# EAGLE schematic covertwmount (EAGLE 9.6.2)
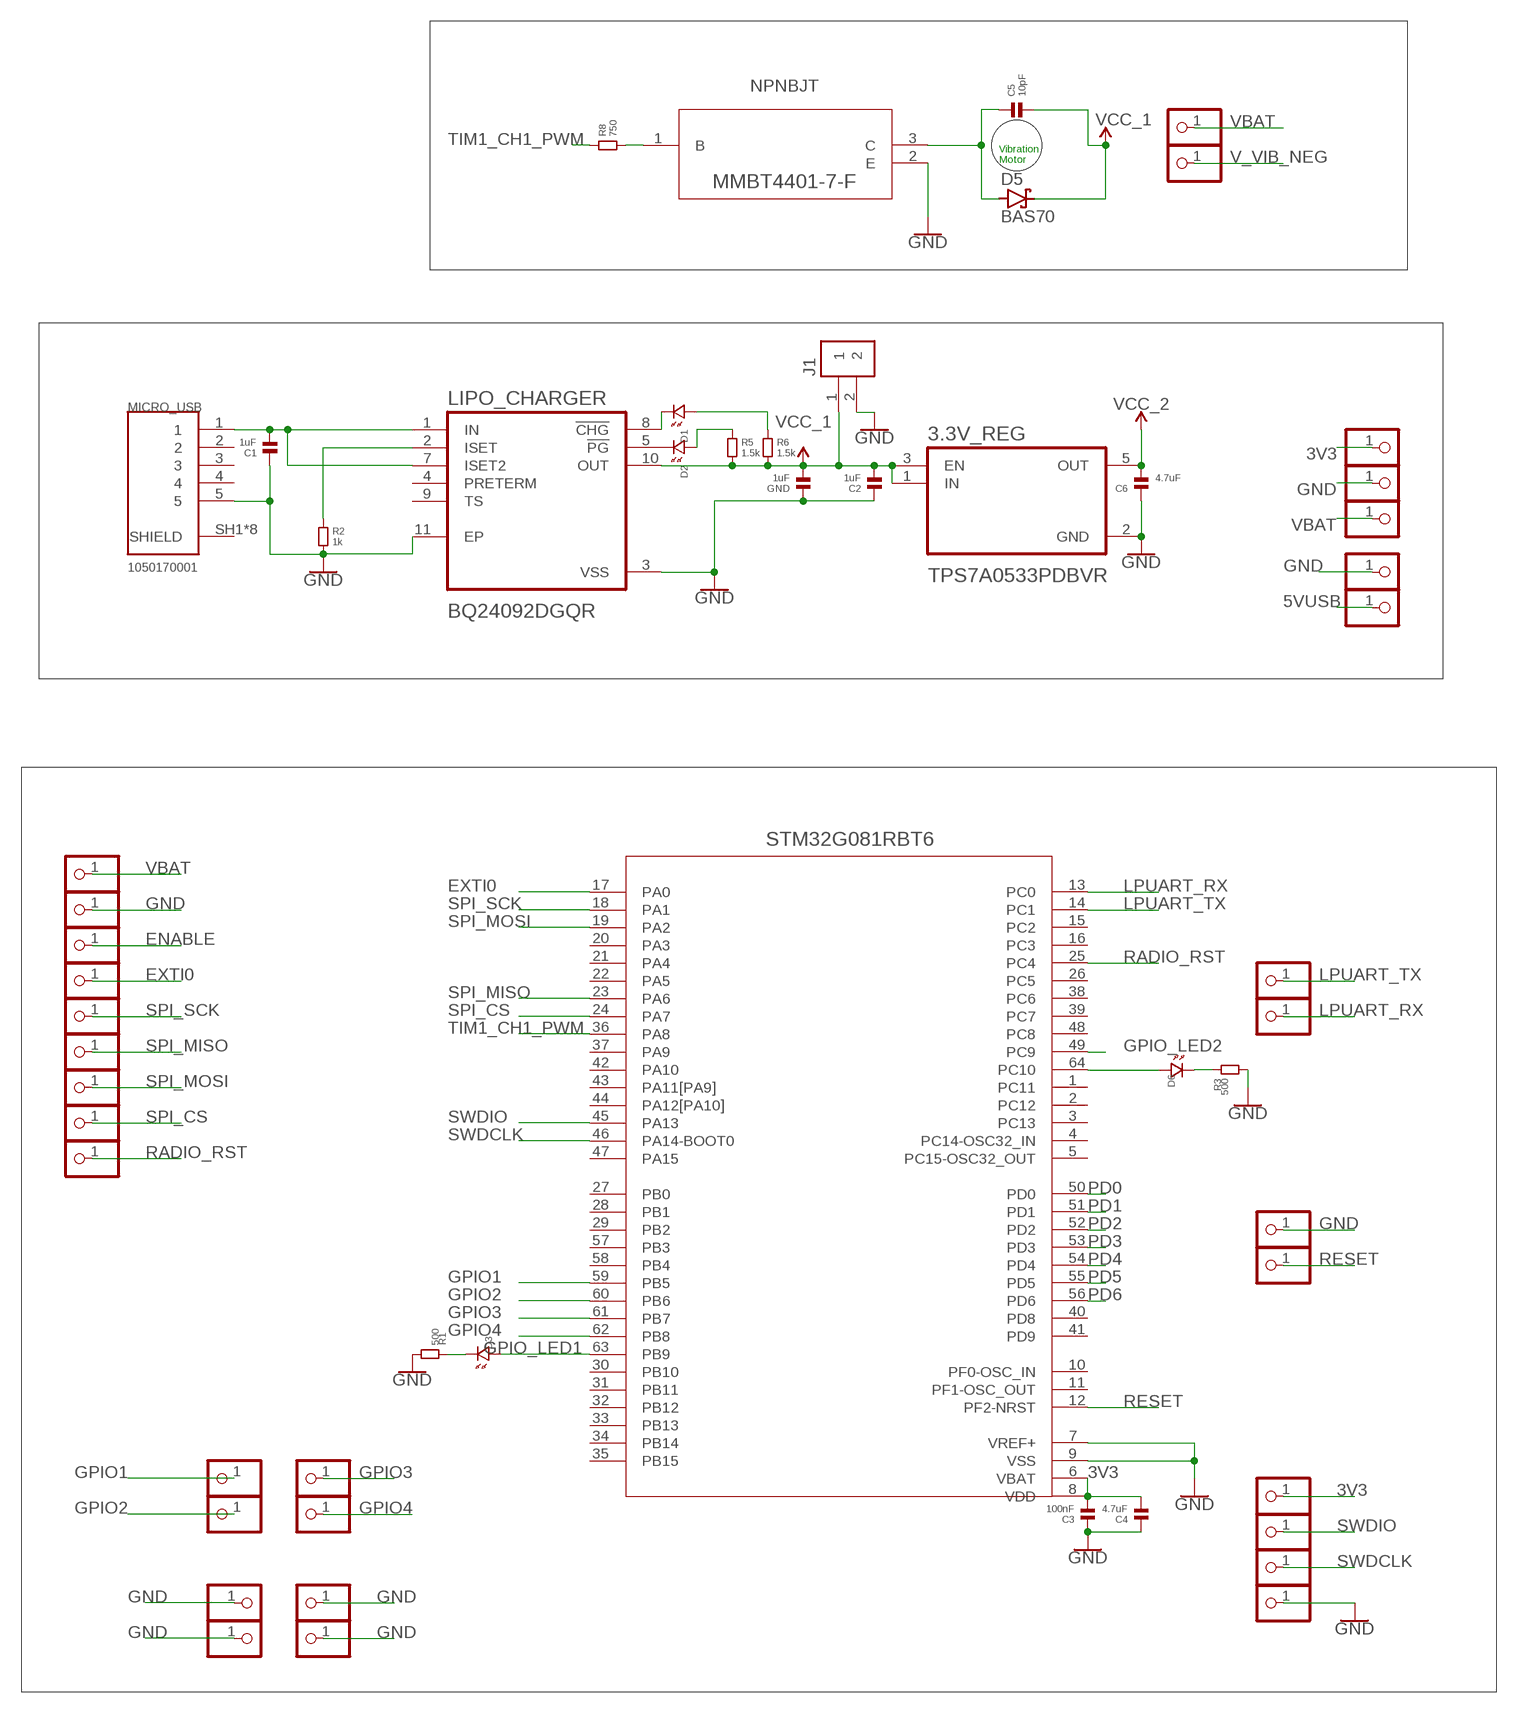
[diagram p0: schematic, sheet 1]

## Parts
3.3V_REG  TPS7A0533PDBVR  [SOT95P280X145-5N]
C1  1uF  CAPACITOR.0805  [0805]
C2  1uF  CAPACITOR.0805  [0805]
C3  100nF  CAPACITOR.0805  [0805]
C4  4.7uF  CAPACITOR.0805  [0805]
C5  10pF  CAPACITOR.0805  [0805]
C6  4.7uF  CAPACITOR.0805  [0805]
D1  LED.0805  [0805.LED]
D2  LED.0805  [0805.LED]
D3  LED.0805  [0805.LED]
D5  BAS70  [SOT23]
D6  LED.0805  [0805.LED]
GND  1uF  CAPACITOR.0805  [0805]
J1  B2B-PH-K-S(LF)(SN)  [JST_B2B-PH-K-S(LF)(SN)]
JP1  PINHD-1X1  [1X01]
JP2  PINHD-1X1  [1X01]
JP3  PINHD-1X1  [1X01]
JP4  PINHD-1X1  [1X01]
JP5  PINHD-1X1  [1X01]
JP6  PINHD-1X1  [1X01]
JP7  PINHD-1X1  [1X01]
JP8  PINHD-1X1  [1X01]
JP9  PINHD-1X1  [1X01]
JP10  PINHD-1X1  [1X01]
JP11  PINHD-1X1  [1X01]
JP12  PINHD-1X1  [1X01]
JP13  PINHD-1X1  [1X01]
JP14  PINHD-1X1  [1X01]
JP15  PINHD-1X1  [1X01]
JP16  PINHD-1X1  [1X01]
JP17  PINHD-1X1  [1X01]
JP18  PINHD-1X1  [1X01]
JP19  PINHD-1X1  [1X01]
JP20  PINHD-1X1  [1X01]
JP21  PINHD-1X1  [1X01]
JP22  PINHD-1X1  [1X01]
JP23  PINHD-1X1  [1X01]
JP24  PINHD-1X1  [1X01]
JP26  PINHD-1X1  [1X01]
JP27  PINHD-1X1  [1X01]
JP28  PINHD-1X1  [1X01]
JP29  PINHD-1X1  [1X01]
JP30  PINHD-1X1  [1X01]
JP31  PINHD-1X1  [1X01]
JP32  PINHD-1X1  [1X01]
JP33  PINHD-1X1  [1X01]
LIPO_CHARGER  BQ24092DGQR  [IC_XTR111AIDGQR]
MICRO_USB  1050170001  [MOLEX_1050170001]
R1  500  RESISTOR.0805  [0805]
R2  1k  RESISTOR.0805  [0805]
R3  500  RESISTOR.0805  [0805]
R5  1.5k  RESISTOR.0805  [0805]
R6  1.5k  RESISTOR.0805  [0805]
R8  750  RESISTOR.0805  [0805]
U1  STM32G081RBT6  [LQFP-64]
U2  MMBT4401-7-F  [SOT-23_DIO]

## Nets
3V3: 3.3V_REG.5(OUT) C3.2 C4.2 C6.2 JP4.1 JP16.1 U1.6(VBAT) U1.8(VDD) ; supply symbol labelled VCC_2
5VUSB: C1.2 JP30.1 LIPO_CHARGER.1(IN) LIPO_CHARGER.7(ISET2) MICRO_USB.1
ENABLE: JP11.1
EXTI0: JP10.1 U1.17(PA0)
GND: 3.3V_REG.2(GND) C1.1 C2.1 C3.1 C4.1 C6.1 GND.1 J1.2 JP3.1 JP12.1 JP15.1 JP23.1 JP26.1 JP27.1 JP28.1 JP29.1 JP33.1 LIPO_CHARGER.3(VSS) LIPO_CHARGER.11(EP) MICRO_USB.5 R1.1 R2.2 R3.1 U1.7(VREF+) U1.9(VSS) U2.2(E)
GPIO1: JP19.1 U1.59(PB5)
GPIO2: JP20.1 U1.60(PB6)
GPIO3: JP17.1 U1.61(PB7)
GPIO4: JP18.1 U1.62(PB8)
GPIO_LED1: D3.P$1 U1.63(PB9)
GPIO_LED2: D6.P$1 U1.64(PC10)
LPUART_RX: JP32.1 U1.13(PC0)
LPUART_TX: JP31.1 U1.14(PC1)
N$1: LIPO_CHARGER.2(ISET) R2.1
N$2: D6.P$2 R3.2
N$3: D3.P$2 R1.2
N$4: U1.49(PC9)
N$5: D2.P$1 R5.1
N$6: D1.P$1 R6.1
N$7: D2.P$2 LIPO_CHARGER.5(!PG)
N$8: R8.2 U2.1(B)
N$11: D1.P$2 LIPO_CHARGER.8(!CHG)
PD0: U1.50(PD0)
PD1: U1.51(PD1)
PD2: U1.52(PD2)
PD3: U1.53(PD3)
PD4: U1.54(PD4)
PD5: U1.55(PD5)
PD6: U1.56(PD6)
RADIO_RST: JP5.1 U1.25(PC4)
RESET: JP24.1 U1.12(PF2-NRST)
SPI_CS: JP6.1 U1.24(PA7)
SPI_MISO: JP8.1 U1.23(PA6)
SPI_MOSI: JP7.1 U1.19(PA2)
SPI_SCK: JP9.1 U1.18(PA1)
SWDCLK: JP2.1 U1.46(PA14-BOOT0)
SWDIO: JP1.1 U1.45(PA13)
TIM1_CH1_PWM: R8.1 U1.36(PA8)
V_VIB_NEG: C5.1 D5.1(A) JP22.1 U2.3(C)
VBAT: 3.3V_REG.1(IN) 3.3V_REG.3(EN) C2.2 C5.2 D5.3(C) GND.2 J1.1 JP13.1 JP14.1 JP21.1 LIPO_CHARGER.10(OUT) R5.2 R6.2 ; supply symbol labelled VCC_1
Unconnected: LIPO_CHARGER.4(PRETERM) LIPO_CHARGER.9(TS) MICRO_USB.2 MICRO_USB.3 MICRO_USB.4 MICRO_USB.SH1(SHIELD) MICRO_USB.SH2(SHIELD) MICRO_USB.SH3(SHIELD) MICRO_USB.SH4(SHIELD) MICRO_USB.SH5(SHIELD) MICRO_USB.SH6(SHIELD) MICRO_USB.SH7(SHIELD) MICRO_USB.SH8(SHIELD) U1.1(PC11) U1.2(PC12) U1.3(PC13) U1.4(PC14-OSC32_IN) U1.5(PC15-OSC32_OUT) U1.10(PF0-OSC_IN) U1.11(PF1-OSC_OUT) U1.15(PC2) U1.16(PC3) U1.20(PA3) U1.21(PA4) U1.22(PA5) U1.26(PC5) U1.27(PB0) U1.28(PB1) U1.29(PB2) U1.30(PB10) U1.31(PB11) U1.32(PB12) U1.33(PB13) U1.34(PB14) U1.35(PB15) U1.37(PA9) U1.38(PC6) U1.39(PC7) U1.40(PD8) U1.41(PD9) U1.42(PA10) U1.43(PA11[PA9]) U1.44(PA12[PA10]) U1.47(PA15) U1.48(PC8) U1.57(PB3) U1.58(PB4)

## Notes on the sheet
- Vibration
  Motor

## Library data of the parts
3.3V_REG = TPS7A0533PDBVR:TPS7A0533PDBVR; DESCRIPTION: 200-mA, ultra-low-IQ, high-accuracy, low-dropout voltage regulator with enable 5-SOT-23 -40 to 125; DIGI-KEY_PART_NUMBER: 296-TPS7A0533PDBVRCT-ND; MF: Texas Instruments; MP: TPS7A0533PDBVR; PACKAGE: SOT-23-5 Texas Instruments; PURCHASE-URL: https://pricing.snapeda.com/search/part/TPS7A0533PDBVR/?ref=eda
C1-C6 GND = standardparts:CAPACITOR
D1-D3 D6 = standardparts:LED
D5 = diode:BAS70: Silicon Schottky Diodes General-purpose diode for high-speed switching
J1 = B2B-PH-K-S_LF__SN_:B2B-PH-K-S(LF)(SN): PH Series 2 Position 2 mm Pitch Through Hole Top Entry Shrouded Header; DESCRIPTION: Connector Header Through Hole 2 position 0.079 (2.00mm); DIGI-KEY_PART_NUMBER: 455-1704-ND; MF: JST Sales; MP: B2B-PH-K-S(LF)(SN); PACKAGE: None; PURCHASE-URL: https://pricing.snapeda.com/search/part/B2B-PH-K-S(LF)(SN)/?ref=eda
JP1-JP24 JP26-JP33 = pinhead:PINHD-1X1: PIN HEADER
LIPO_CHARGER = BQ24092DGQR:BQ24092DGQR; DESCRIPTION: 1-cell, 1-A, Li-ion battery charger with operation over JEITA and 10k? NTC 10-HVSSOP -40 to 150; DIGI-KEY_PART_NUMBER: 296-41204-1-ND; MF: Texas Instruments; MP: BQ24092DGQR; PACKAGE: HVSSOP-10 Texas Instruments; PURCHASE-URL: https://pricing.snapeda.com/search/part/BQ24092DGQR/?ref=eda
MICRO_USB = 1050170001:1050170001: Conn.; Data; USB; Recept.; Micro; B Type; Bottom Mount, SMT, with Solder Tabs, Lead-Free; DESCRIPTION: USB - micro B USB 2.0 Receptacle Connector 5 Position Surface Mount, Right Angle; Through Hole; DIGI-KEY_PART_NUMBER: WM1399CT-ND; MF: Molex; MP: 1050170001; PACKAGE: None; PURCHASE-URL: https://pricing.snapeda.com/search/part/1050170001/?ref=eda
R1-R3 R5 R6 R8 = standardparts:RESISTOR
U1 = STM32G081RBT6v3:STM32G081RBT6; BUILT_BY: EMA_UL_Team; COPYRIGHT: Copyright (C) 2018 Accelerated Designs. All rights reserved; MANUFACTURER_PART_NUMBER: STM32G081RBT6; SOURCELIBRARY: Updates_to_database_2020-10-19; VENDOR: STMicroelectronics
U2 = MMBT4401-7-F:MMBT4401-7-F; BUILT_BY: EMA_UL_Team; MANUFACTURER_PART_NUMBER: MMBT4401-7-F; SOURCELIBRARY: DIODESINC_2_2015-08-18; VENDOR: Diodes Inc